# Altium project BF6底板.PrjPCB
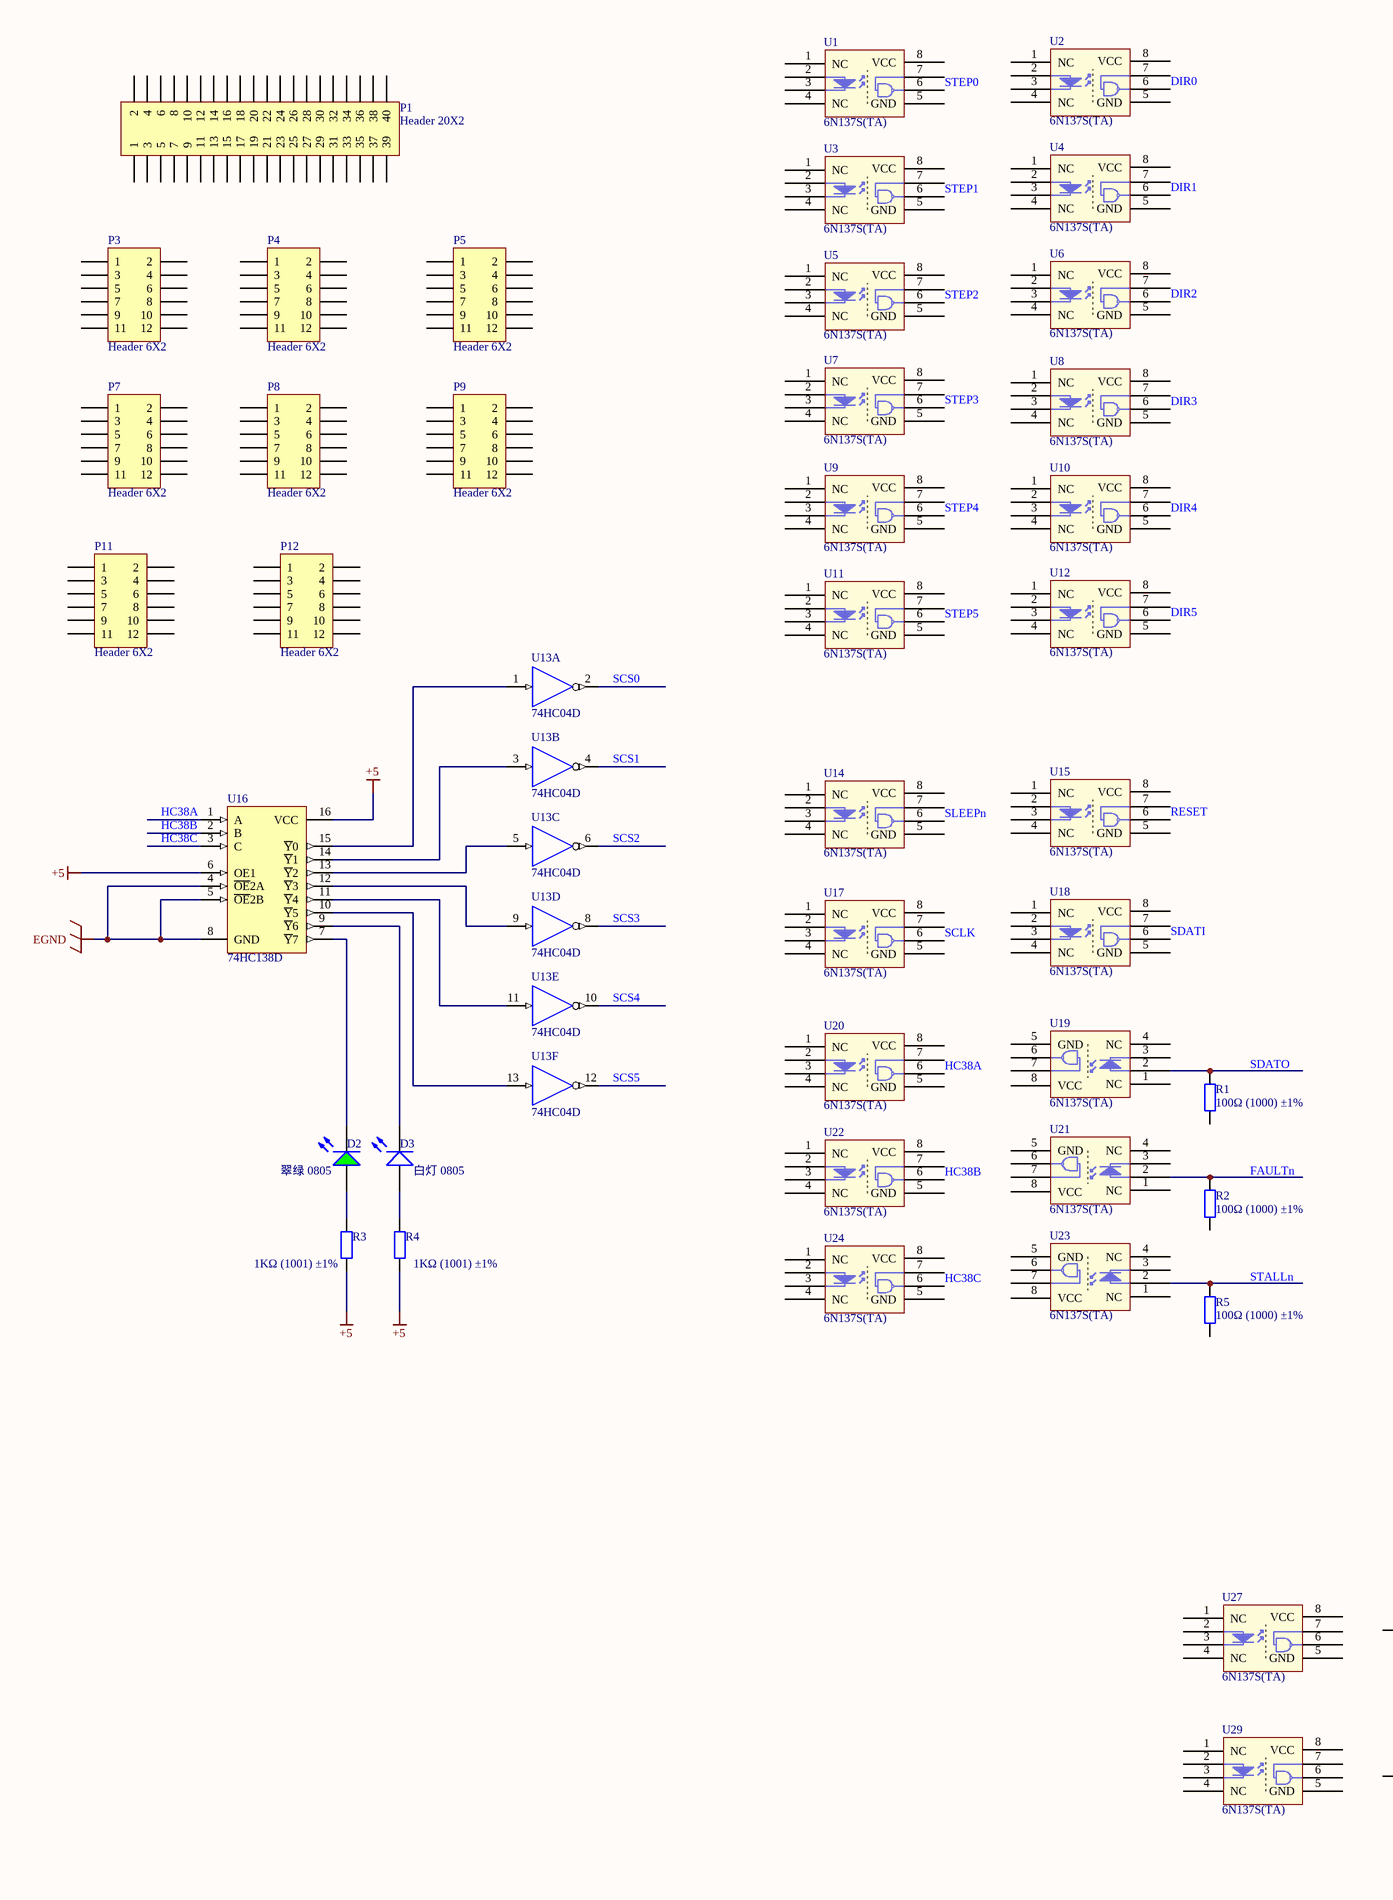
[diagram p0: BF6底板.SchDoc, left]
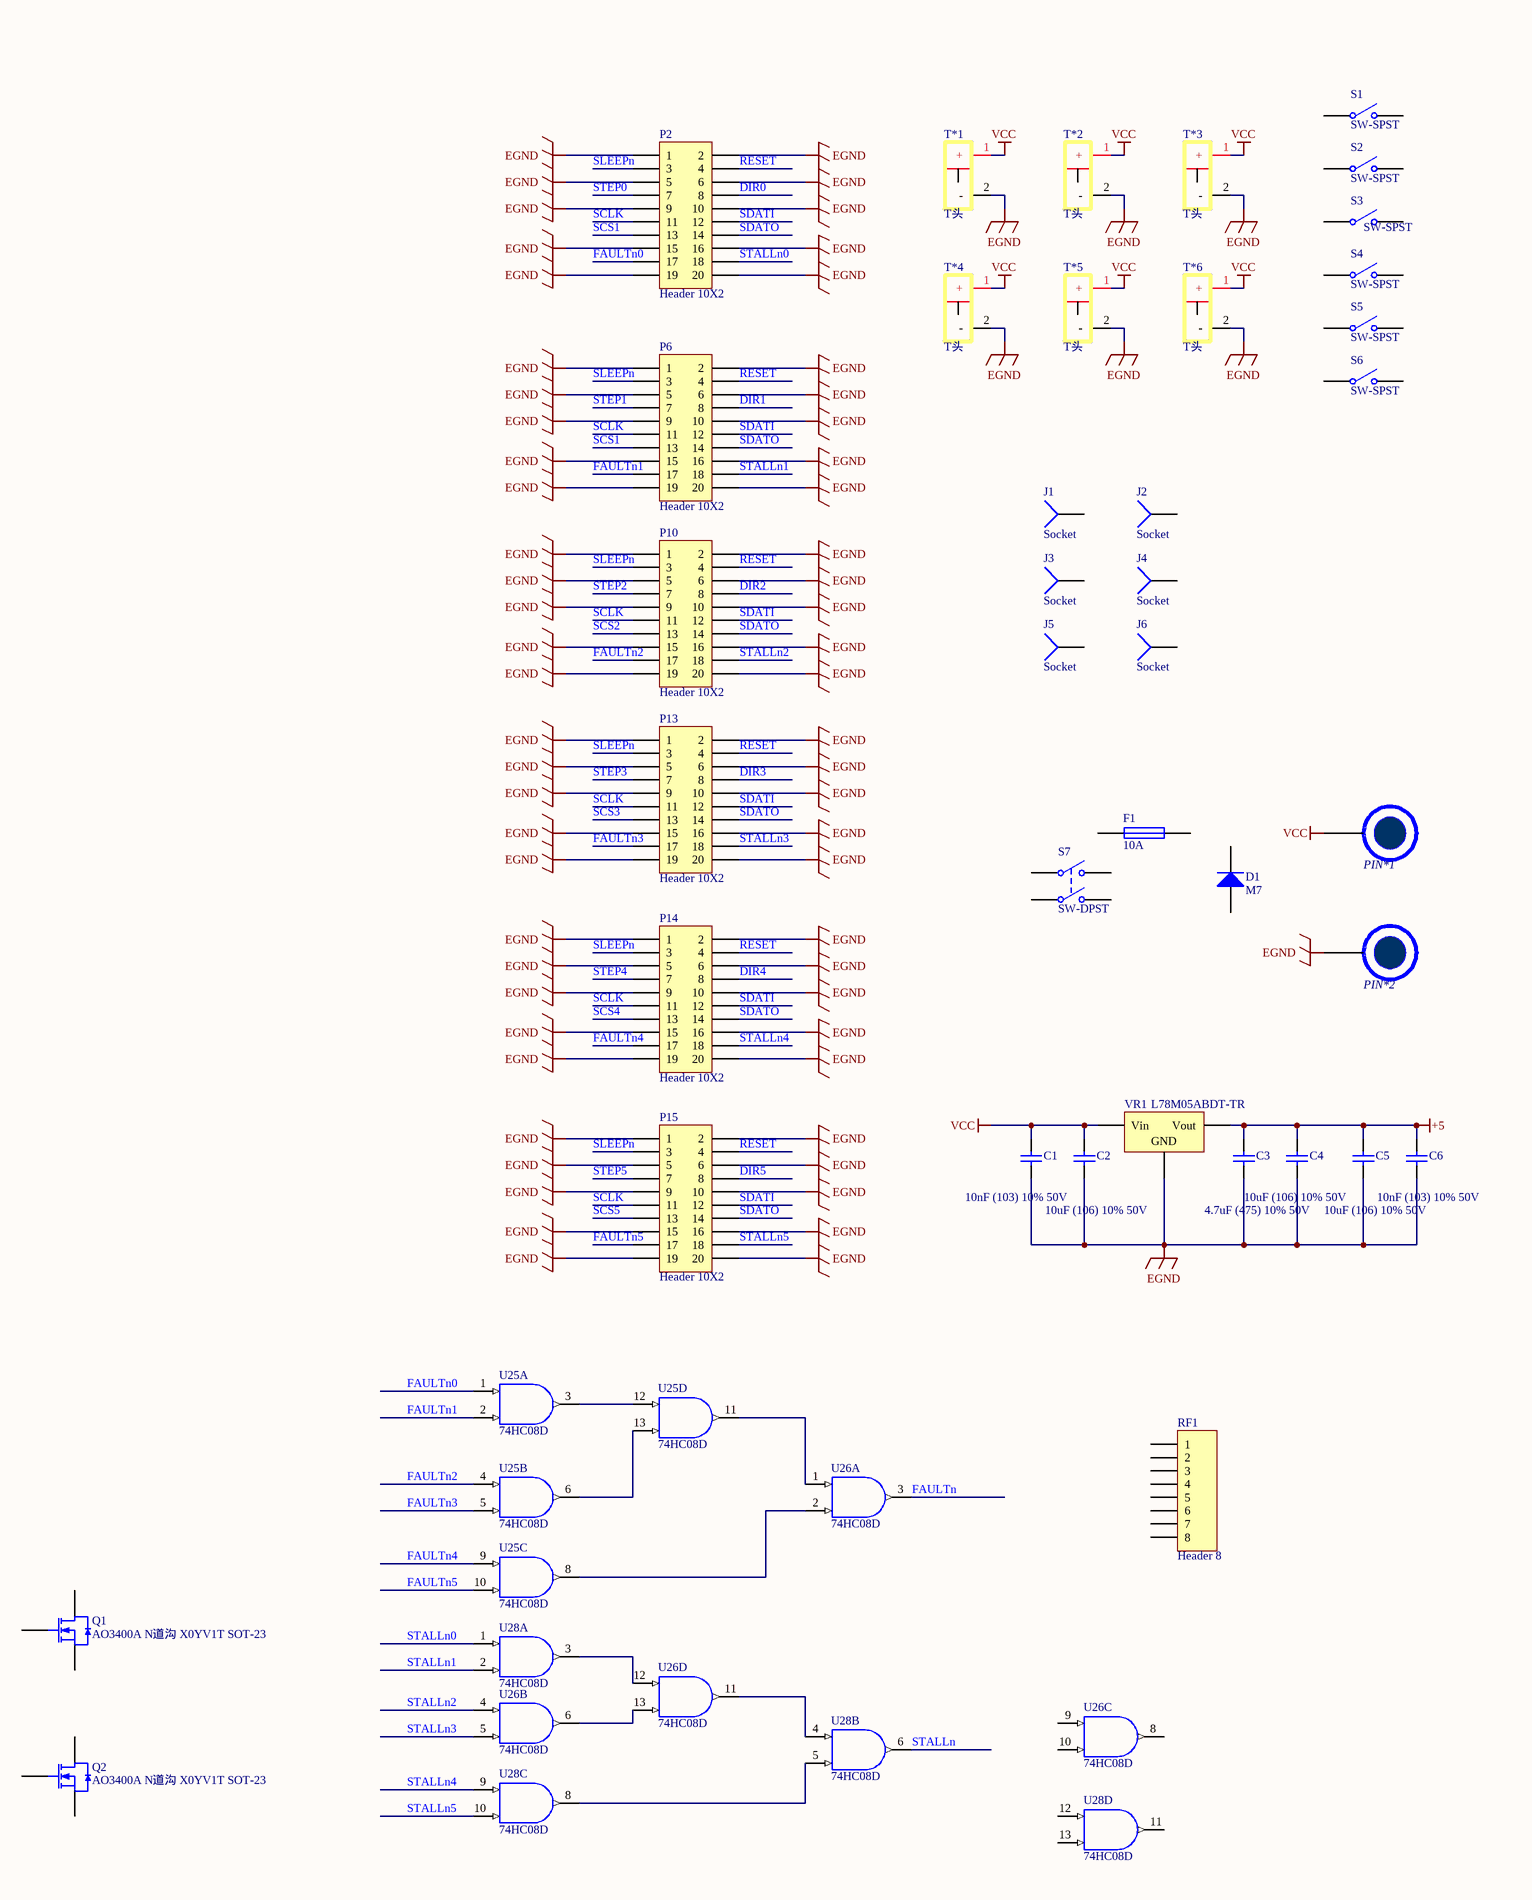
[diagram p1: BF6底板.SchDoc, right]
2 sheets, 84 parts. Net scope: global (net labels, ports and power ports of the same name join across sheets).
Board file: BF6底板.PcbDoc
Sheets:
  DRV8711.SchDoc
  BF6底板.SchDoc

## Sheet DRV8711.SchDoc
size A3

## Sheet BF6底板.SchDoc
size A2

### Parts
C1  10nF (103) 10% 50V  [1206_C]
C2  10uF (106) 10% 50V  [1206_C]
C3  4.7uF (475) 10% 50V  [1206_C]
C4  10uF (106) 10% 50V  [1206_C]
C5  10uF (106) 10% 50V  [1206_C]
C6  10nF (103) 10% 50V  [1206_C]
D1  M7  [SMA(DO-214AC)_S1]
D2  翠绿 0805  [0805_LED_S1]
D3  白灯 0805  [0805_LED_S1]
F1  10A  [0805(2012)]
J1  Socket  [PCBComponent_1]
J2  Socket  [PCBComponent_1]
J3  Socket  [PCBComponent_1]
J4  Socket  [PCBComponent_1]
J5  Socket  [PCBComponent_1]
J6  Socket  [PCBComponent_1]
P1  Header 20X2  [HDR2X20]
P2  Header 10X2  [HDR2X10]
P3  Header 6X2  [HDR2X6]
P4  Header 6X2  [HDR2X6]
P5  Header 6X2  [HDR2X6]
P6  Header 10X2  [HDR2X10]
P7  Header 6X2  [HDR2X6]
P8  Header 6X2  [HDR2X6]
P9  Header 6X2  [HDR2X6]
P10  Header 10X2  [HDR2X10]
P11  Header 6X2  [HDR2X6]
P12  Header 6X2  [HDR2X6]
P13  Header 10X2  [HDR2X10]
P14  Header 10X2  [HDR2X10]
P15  Header 10X2  [HDR2X10]
PIN*1  PIN  [PIN]  (value not drawn)
PIN*2  PIN  [PIN]  (value not drawn)
Q1  AO3400A N道沟 X0YV1T SOT-23  [SOT-23-3L]
Q2  AO3400A N道沟 X0YV1T SOT-23  [SOT-23-3L]
R1  100Ω (1000) ±1%  [1206_R]
R2  100Ω (1000) ±1%  [1206_R]
R3  1KΩ (1001) ±1%  [0402_R]
R4  1KΩ (1001) ±1%  [0402_R]
R5  100Ω (1000) ±1%  [1206_R]
RF1  Header 8  [HDR1X8]
S1  SW-SPST  [SPST-2]
S2  SW-SPST  [SPST-2]
S3  SW-SPST  [SPST-2]
S4  SW-SPST  [SPST-2]
S5  SW-SPST  [SPST-2]
S6  SW-SPST  [SPST-2]
S7  SW-DPST  [DPST-4]
T*1  T头  [T插]
T*2  T头  [T插]
T*3  T头  [T插]
T*4  T头  [T插]
T*5  T头  [T插]
T*6  T头  [T插]
U1  6N137S(TA)  [SMD-8_6.3mm]
U2  6N137S(TA)  [SMD-8_6.3mm]
U3  6N137S(TA)  [SMD-8_6.3mm]
U4  6N137S(TA)  [SMD-8_6.3mm]
U5  6N137S(TA)  [SMD-8_6.3mm]
U6  6N137S(TA)  [SMD-8_6.3mm]
U7  6N137S(TA)  [SMD-8_6.3mm]
U8  6N137S(TA)  [SMD-8_6.3mm]
U9  6N137S(TA)  [SMD-8_6.3mm]
U10  6N137S(TA)  [SMD-8_6.3mm]
U11  6N137S(TA)  [SMD-8_6.3mm]
U12  6N137S(TA)  [SMD-8_6.3mm]
U13  74HC04D  [SOIC-14_150mil]  (parts A,B,C,D,E,F of 6)
U14  6N137S(TA)  [SMD-8_6.3mm]
U15  6N137S(TA)  [SMD-8_6.3mm]
U16  74HC138D  [SOIC-16_150mil]
U17  6N137S(TA)  [SMD-8_6.3mm]
U18  6N137S(TA)  [SMD-8_6.3mm]
U19  6N137S(TA)  [SMD-8_6.3mm]
U20  6N137S(TA)  [SMD-8_6.3mm]
U21  6N137S(TA)  [SMD-8_6.3mm]
U22  6N137S(TA)  [SMD-8_6.3mm]
U23  6N137S(TA)  [SMD-8_6.3mm]
U24  6N137S(TA)  [SMD-8_6.3mm]
U25  74HC08D  [SOIC-14_150mil]  (parts A,B,C,D of 4)
U26  74HC08D  [SOIC-14_150mil]  (parts A,B,C,D of 4)
U27  6N137S(TA)  [SMD-8_6.3mm]
U28  74HC08D  [SOIC-14_150mil]  (parts A,B,C,D of 4)
U29  6N137S(TA)  [SMD-8_6.3mm]
VR1  L78M05ABDT-TR  [TO-252-2-180]

### Nets
+5: C3.2 C4.2 C5.2 C6.2 R3.1 R4.1 U16.6(OE1) U16.16(VCC) VR1.3(Vout)
EGND: C1.1 C2.1 C3.1 C4.1 C5.1 C6.1 P2.1 P2.2 P2.5 P2.6 P2.9 P2.10 P2.15 P2.16 P2.19 P2.20 P6.1 P6.2 P6.5 P6.6 P6.9 P6.10 P6.15 P6.16 P6.19 P6.20 P10.1 P10.2 P10.5 P10.6 P10.9 P10.10 P10.15 P10.16 P10.19 P10.20 P13.1 P13.2 P13.5 P13.6 P13.9 P13.10 P13.15 P13.16 P13.19 P13.20 P14.1 P14.2 P14.5 P14.6 P14.9 P14.10 P14.15 P14.16 P14.19 P14.20 P15.1 P15.2 P15.5 P15.6 P15.9 P15.10 P15.15 P15.16 P15.19 P15.20 PIN*2.1(PIN) T*1.2(-) T*2.2(-) T*3.2(-) T*4.2(-) T*5.2(-) T*6.2(-) U16.4(~{OE}2A) U16.5(~{OE}2B) U16.8(GND) VR1.2(GND)
VCC: C1.2 C2.2 PIN*1.1(PIN) T*1.1(+) T*2.1(+) T*3.1(+) T*4.1(+) T*5.1(+) T*6.1(+) VR1.1(Vin)
DIR0: P2.8 U2.6(VO)
DIR1: P6.8 U4.6(VO)
DIR2: P10.8 U6.6(VO)
DIR3: P13.8 U8.6(VO)
DIR4: P14.8 U10.6(VO)
DIR5: P15.8 U12.6(VO)
FAULTn: U26.3(Y)
FAULTn0: P2.17 U25.1(A)
FAULTn1: P6.17 U25.2(B)
FAULTn2: P10.17 U25.4(A)
FAULTn3: P13.17 U25.5(B)
FAULTn4: P14.17 U25.9(A)
FAULTn5: P15.17 U25.10(B)
HC38A: U16.1(A) U20.6(VO)
HC38B: U16.2(B) U22.6(VO)
HC38C: U16.3(C) U24.6(VO)
RESET: P2.4 P6.4 P10.4 P13.4 P14.4 P15.4 U15.6(VO)
SCLK: P2.11 P6.11 P10.11 P13.11 P14.11 P15.11 U17.6(VO)
SCS0: U13.2(Y)
SCS1: P2.13 P6.13 U13.4(Y)
SCS2: P10.13 U13.6(Y)
SCS3: P13.13 U13.8(Y)
SCS4: P14.13 U13.10(Y)
SCS5: P15.13 U13.12(Y)
SDATI: P2.12 P6.12 P10.12 P13.12 P14.12 P15.12 U18.6(VO)
SDATO: P2.14 P6.14 P10.14 P13.14 P14.14 P15.14
SLEEPn: P2.3 P6.3 P10.3 P13.3 P14.3 P15.3 U14.6(VO)
STALLn: U28.6(Y)
STALLn0: P2.18 U28.1(A)
STALLn1: P6.18 U28.2(B)
STALLn2: P10.18 U26.4(A)
STALLn3: P13.18 U26.5(B)
STALLn4: P14.18 U28.9(A)
STALLn5: P15.18 U28.10(B)
STEP0: P2.7 U1.6(VO)
STEP1: P6.7 U3.6(VO)
STEP2: P10.7 U5.6(VO)
STEP3: P13.7 U7.6(VO)
STEP4: P14.7 U9.6(VO)
STEP5: P15.7 U11.6(VO)
NetD2_A: D2.A R3.2
NetD2_K: D2.K U16.7(~{Y}7)
NetD3_A: D3.A R4.2
NetD3_K: D3.K U16.9(~{Y}6)
NetR1_1: R1.1 U19.2(A)
NetR2_1: R2.1 U21.2(A)
NetR5_1: R5.1 U23.2(A)
NetU13_1: U13.1(A) U16.15(~{Y}0)
NetU13_3: U13.3(A) U16.14(~{Y}1)
NetU13_5: U13.5(A) U16.13(~{Y}2)
NetU13_9: U13.9(A) U16.12(~{Y}3)
NetU13_11: U13.11(A) U16.11(~{Y}4)
NetU13_13: U13.13(A) U16.10(~{Y}5)
NetU25_3: U25.3(Y) U25.12(A)
NetU25_6: U25.6(Y) U25.13(B)
NetU25_8: U25.8(Y) U26.2(B)
NetU25_11: U25.11(Y) U26.1(A)
NetU26_6: U26.6(Y) U26.13(B)
NetU26_11: U26.11(Y) U28.4(A)
NetU26_12: U26.12(A) U28.3(Y)
NetU28_5: U28.5(B) U28.8(Y)

Not connected (* = marked no-connect by the designer): D1 1(A) 2(K); F1 1 2; J1 1; J2 1; J3 1; J4 1; J5 1; J6 1; P1 1 2 3 4 5 6 7 8 9 10 11 12 13 14 15 16 17 18 19 20 21 22 23 24 25 26 27 28 29 30 31 32 33 34 35 36 37 38 39 40; P3 1 2 3 4 5 6 7 8 9 10 11 12; P4 1 2 3 4 5 6 7 8 9 10 11 12; P5 1 2 3 4 5 6 7 8 9 10 11 12; P7 1 2 3 4 5 6 7 8 9 10 11 12; P8 1 2 3 4 5 6 7 8 9 10 11 12; P9 1 2 3 4 5 6 7 8 9 10 11 12; P11 1 2 3 4 5 6 7 8 9 10 11 12; P12 1 2 3 4 5 6 7 8 9 10 11 12; Q1 1(G) 2(S) 3(D); Q2 1(G) 2(S) 3(D); R1 2; R2 2; R5 2; RF1 1 2 3 4 5 6 7 8; S1 1(COMMON) 2(NO); S2 1(COMMON) 2(NO); S3 1(COMMON) 2(NO); S4 1(COMMON) 2(NO); S5 1(COMMON) 2(NO); S6 1(COMMON) 2(NO); S7 1(COMMON1) 2(NO1) 3(COMMON2) 4(NO2); U1 1(NC) 2(A) 3(K) 4(NC) 5(GND) 7(VE) 8(VCC); U2 1(NC) 2(A) 3(K) 4(NC) 5(GND) 7(VE) 8(VCC); U3 1(NC) 2(A) 3(K) 4(NC) 5(GND) 7(VE) 8(VCC); U4 1(NC) 2(A) 3(K) 4(NC) 5(GND) 7(VE) 8(VCC); U5 1(NC) 2(A) 3(K) 4(NC) 5(GND) 7(VE) 8(VCC); U6 1(NC) 2(A) 3(K) 4(NC) 5(GND) 7(VE) 8(VCC); U7 1(NC) 2(A) 3(K) 4(NC) 5(GND) 7(VE) 8(VCC); U8 1(NC) 2(A) 3(K) 4(NC) 5(GND) 7(VE) 8(VCC); U9 1(NC) 2(A) 3(K) 4(NC) 5(GND) 7(VE) 8(VCC); U10 1(NC) 2(A) 3(K) 4(NC) 5(GND) 7(VE) 8(VCC); U11 1(NC) 2(A) 3(K) 4(NC) 5(GND) 7(VE) 8(VCC); U12 1(NC) 2(A) 3(K) 4(NC) 5(GND) 7(VE) 8(VCC); U13 7(GND) 14(VDD); U14 1(NC) 2(A) 3(K) 4(NC) 5(GND) 7(VE) 8(VCC); U15 1(NC) 2(A) 3(K) 4(NC) 5(GND) 7(VE) 8(VCC); U17 1(NC) 2(A) 3(K) 4(NC) 5(GND) 7(VE) 8(VCC); U18 1(NC) 2(A) 3(K) 4(NC) 5(GND) 7(VE) 8(VCC); U19 1(NC) 3(K) 4(NC) 5(GND) 6(VO) 7(VE) 8(VCC); U20 1(NC) 2(A) 3(K) 4(NC) 5(GND) 7(VE) 8(VCC); U21 1(NC) 3(K) 4(NC) 5(GND) 6(VO) 7(VE) 8(VCC); U22 1(NC) 2(A) 3(K) 4(NC) 5(GND) 7(VE) 8(VCC); U23 1(NC) 3(K) 4(NC) 5(GND) 6(VO) 7(VE) 8(VCC); U24 1(NC) 2(A) 3(K) 4(NC) 5(GND) 7(VE) 8(VCC); U25 7(GND) 14(VDD); U26 7(GND) 8(Y) 9(A) 10(B) 14(VDD); U27 1(NC) 2(A) 3(K) 4(NC) 5(GND) 6(VO) 7(VE) 8(VCC); U28 7(GND) 11(Y) 12(A) 13(B) 14(VDD); U29 1(NC) 2(A) 3(K) 4(NC) 5(GND) 6(VO) 7(VE) 8(VCC)

### Notes on the sheet
- Labels drawn without touching a wire or pin: FAULTn, SDATO, STALLn

### Library data of the parts
C1 C6 = 1206 10nF (103) 10% 50V: 贴片电容; ComponentLink1Description: 供应商链接; ComponentLink1URL: http://www.szlcsc.com/product/details_2198.html; Package: 1206; Supplier: LC; SuppliersPartNumber: C1846
C2 C4 C5 = 1206 10uF (106) 10% 50V: 贴片电容; ComponentLink1Description: 供应商链接; ComponentLink1URL: http://www.szlcsc.com/product/details_14236.html; Package: 1206; Supplier: LC; SuppliersPartNumber: C13585
C3 = 1206 4.7uF (475) 10% 50V: 贴片电容; ComponentLink1Description: 供应商链接; ComponentLink1URL: http://www.szlcsc.com/product/details_30577.html; Package: 1206; Supplier: LC; SuppliersPartNumber: C29823
D1 = SMA(DO-214AC) M7: 二极管; 备注: 1N4007 4007 编号C2464 已经停售, 使用新物料编号C95872; ComponentLink1Description: 供应商链接; ComponentLink1URL: http://www.szlcsc.com/product/details_2841.html; Package: SMA(DO-214AC); Supplier: LC; SuppliersPartNumber: C95872
D2 = 0805 翠绿: 发光二极管; ComponentLink1Description: 供应商链接; ComponentLink1URL: http://www.szlcsc.com/product/details_2670.html; Package: 0805; Supplier: LC; SuppliersPartNumber: C2297
D3 = 0805 白灯: 发光二极管; ComponentLink1Description: 供应商链接; ComponentLink1URL: http://www.szlcsc.com/product/details_35468.html; Package: 0805; Supplier: LC; SuppliersPartNumber: C34499
F1 = Fuse 1: Fuse; Published: 8-Jun-2000; LatestRevisionDate: 17-Jul-2002; LatestRevisionNote: Re-released for DXP Platform.; PackageReference: PIN-W2/E2.8; Publisher: Altium Limited
P1 = Header 20X2: Header, 20-Pin, Dual row; LatestRevisionDate: 17-Jul-2002; LatestRevisionNote: Re-released for DXP Platform.; Publisher: Altium Limited
P2 P6 P10 P13-P15 = Header 10X2: Header, 10-Pin, Dual row; LatestRevisionDate: 17-Jul-2002; LatestRevisionNote: Re-released for DXP Platform.; Publisher: Altium Limited
P3-P5 P7-P9 P11 P12 = Header 6X2: Header, 6-Pin, Dual row; LatestRevisionDate: 17-Jul-2002; LatestRevisionNote: Re-released for DXP Platform.; Publisher: Altium Limited
Q1 Q2 = AO3400A N道沟 X0YV1T SOT-23: MOS(场效应管); ComponentLink1Description: 供应商链接; ComponentLink1URL: http://www.szlcsc.com/product/details_21629.html; Package: SOT-23; Supplier: LC; SuppliersPartNumber: C20917
R1 R2 R5 = 1206 100Ω (1000) 1%: 贴片电阻; ComponentLink1Description: 供应商链接; ComponentLink1URL: http://www.szlcsc.com/product/details_18589.html; Package: 1206; Supplier: LC; SuppliersPartNumber: C17901
R3 R4 = 0402 1KΩ (1001) 1%: 贴片电阻; ComponentLink1Description: 供应商链接; ComponentLink1URL: http://www.szlcsc.com/product/details_12256.html; Package: 0402; Supplier: LC; SuppliersPartNumber: C11702
RF1 = Header 8: Header, 8-Pin; LatestRevisionDate: 17-Jul-2002; LatestRevisionNote: Re-released for DXP Platform.; Publisher: Altium Limited
S1-S6 = SW-SPST: Single-Pole, Single-Throw Switch; Published: 24-Mar-1999; LatestRevisionDate: 17-Jul-2002; LatestRevisionNote: Re-released for DXP Platform.; PackageReference: SPST-2; Publisher: Altium Limited; PackageDescription: Switch; 2 Leads
S7 = SW-DPST: Double-Pole, Single-Throw Switch; Published: 24-Mar-1999; LatestRevisionDate: 17-Jul-2002; LatestRevisionNote: Re-released for DXP Platform.; PackageReference: DPST-4; Publisher: Altium Limited; PackageDescription: Switch; 4 Leads
U1-U12 U14 U15 U17-U24 U27 U29 = 6N137S(TA)_[C16496]: 贴片光耦; ComponentLink1Description: 供应商链接; ComponentLink1URL: http://www.szlcsc.com/product/details_17178.html; Package: SMD-8_6.3mm; Supplier: LC; SuppliersPartNumber: C16496
U13 = 74HC04D_[C5590]: 74系列逻辑芯片; ComponentLink1Description: 供应商链接; ComponentLink1URL: http://www.szlcsc.com/product/details_6041.html; Package: SOIC-14_150mil; Supplier: LC; SuppliersPartNumber: C5590
U16 = 74HC138D_[C5602]: 74系列逻辑芯片; ComponentLink1Description: 供应商链接; ComponentLink1URL: http://www.szlcsc.com/product/details_6053.html; Package: SOIC-16_150mil; Supplier: LC; SuppliersPartNumber: C5602
U25 U26 U28 = 74HC08D_[C5593]: 74系列逻辑芯片; ComponentLink1Description: 供应商链接; ComponentLink1URL: http://www.szlcsc.com/product/details_6044.html; Package: SOIC-14_150mil; Supplier: LC; SuppliersPartNumber: C5593
VR1 = TO-252-2 L78M05ABDT-TR: 低压差线性稳压(LDO); ComponentLink1Description: 供应商链接; ComponentLink1URL: http://www.szlcsc.com/product/details_59107.html; Package: TO-252-2; Supplier: LC; SuppliersPartNumber: C58069
J1-J6 = Socket: LatestRevisionDate: 17-Jul-2002; LatestRevisionNote: Re-released for DXP Platform.; Publisher: Altium Limited